# Altium schematic sheet main.SchDoc
size A4; SheetNumber: 1; SheetTotal: 7
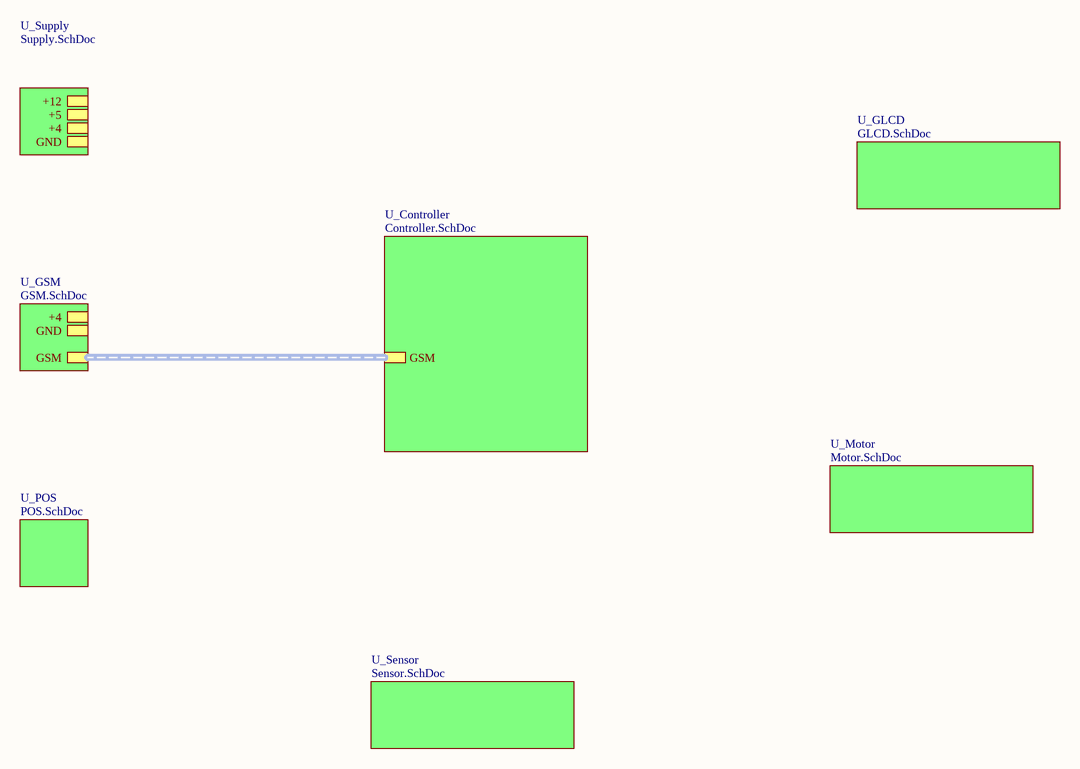
[diagram p0: main.SchDoc]

## Sub-sheets
U_Controller = Controller.SchDoc: GSM (harness GSM)
U_GLCD = GLCD.SchDoc: no entries
U_GSM = GSM.SchDoc: +4, GND, GSM (harness GSM)
U_Motor = Motor.SchDoc: no entries
U_POS = POS.SchDoc: no entries
U_Sensor = Sensor.SchDoc: no entries
U_Supply = Supply.SchDoc: GND, +4, +5, +12

## Buses and harness runs
harness sheet U_Controller/GSM = sheet U_GSM/GSM